# EAGLE design Flight control Prototipe (EAGLE 9.5.2)
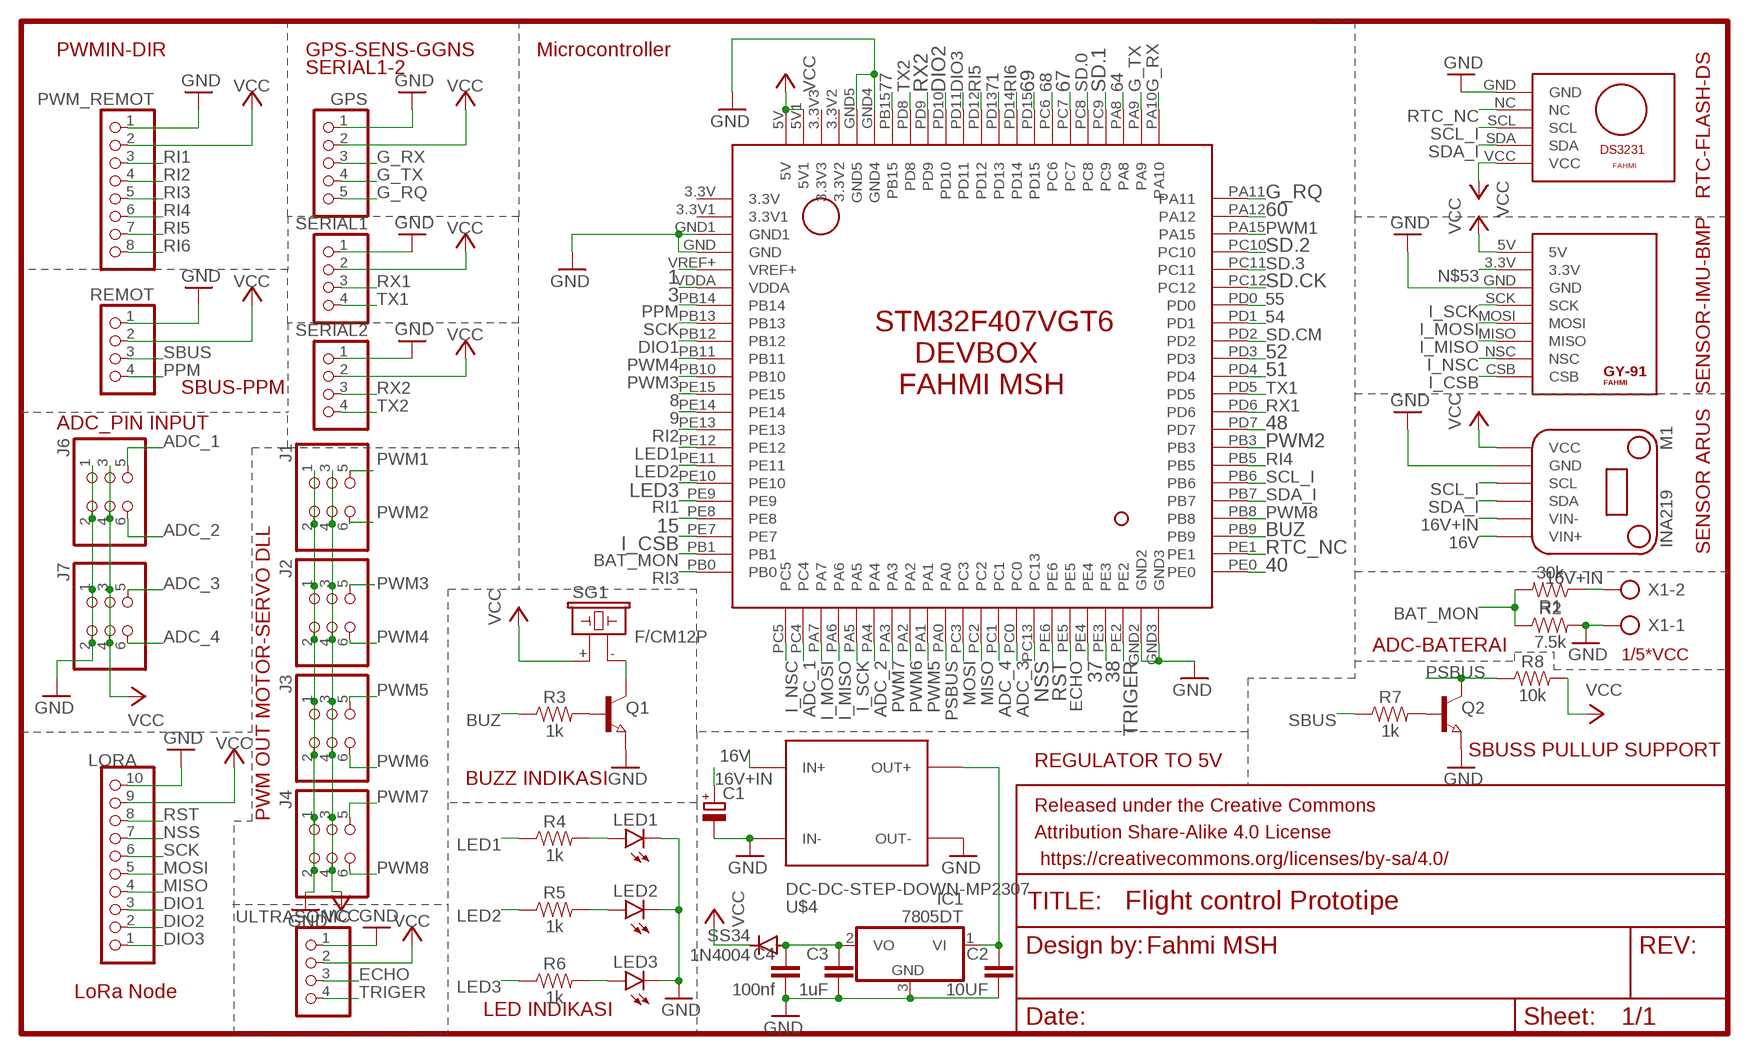
[diagram p0: schematic, sheet 1]

## Parts
C1  CPOL-EUE3.5-8  [E3,5-8]
C2  10UF  C-EUC0805K  [C0805K]
C3  1uF  C-EUC0805K  [C0805K]
C4  100nf  C-EUC0805K  [C0805K]
FRAME1  FRAME-LEDGER  [CREATIVE_COMMONS]
GPS  PINHD-1X5  [1X05]
IC1  7805DT  [TO252]
J1  PINHD-2X3  [2X03]
J2  PINHD-2X3  [2X03]
J3  PINHD-2X3  [2X03]
J4  PINHD-2X3  [2X03]
J6  PINHD-2X3  [2X03]
J7  PINHD-2X3  [2X03]
LED1  LED3MM  [LED3MM]
LED2  LED3MM  [LED3MM]
LED3  LED3MM  [LED3MM]
LORA  PINHD-1X10  [1X10]
M1  INA219  [INA219]
PWM_REMOT  PINHD-1X8  [1X08]
Q1  NPN-TRANSISTOR_SOT23  [SOT23]
Q2  NPN-TRANSISTOR_SOT23  [SOT23]
R1  30k  0.75OHM-0805-1/4W-1%  [0805]
R2  7.5k  0.75OHM-0805-1/4W-1%  [0805]
R3  1k  0.75OHM-0805-1/4W-1%  [0805]
R4  1k  0.75OHM-0805-1/4W-1%  [0805]
R5  1k  0.75OHM-0805-1/4W-1%  [0805]
R6  1k  0.75OHM-0805-1/4W-1%  [0805]
R7  1k  0.75OHM-0805-1/4W-1%  [0805]
R8  10k  0.75OHM-0805-1/4W-1%  [0805]
REMOT  PINHD-1X4  [1X04]
SERIAL1  PINHD-1X4  [1X04]
SERIAL2  PINHD-1X4  [1X04]
SG1  F/CM12P  [F/CM12P]
SS34  1N4004  [DO41-10]
U$1  STM32F4DEVBOX  [STM32F4DEVBOX]
U$2  GY-91  [GY-91]
U$3  DS3231MINI  [DS3231MINI]
U$4  DC-DC-STEP-DOWN-MP2307  [DC-DC-STEP-DOWN-MP2307]
ULTRASONIC  PINHD-1X4  [1X04]
X1  AK500/2  [AK500/2]

## Nets
1: U$1.VREF+
3: U$1.VDDA
8: U$1.PE15
9: U$1.PE14
15: U$1.PE8
16V: M1.VIN+ U$4.IN+
16V+IN: C1.+ M1.VIN- R1.1 X1.2
37: U$1.PE4
38: U$1.PE3
40: U$1.PE0
48: U$1.PD7
51: U$1.PD4
52: U$1.PD3
54: U$1.PD1
55: U$1.PD0
60: U$1.PA12
64: U$1.PA8
67: U$1.PC7
68: U$1.PC6
69: U$1.PD15
71: U$1.PD13
77: U$1.PB15
ADC_1: J6.5 U$1.PC4
ADC_2: J6.6 U$1.PA4
ADC_3: J7.5 U$1.PC0
ADC_4: J7.6 U$1.PC1
BAT_MON: R1.2 R2.1 U$1.PB1
BUZ: R3.1 U$1.PB9
DIO1: LORA.3 U$1.PB12
DIO2: LORA.2 U$1.PD10
DIO3: LORA.1 U$1.PD11
ECHO: U$1.PE5 ULTRASONIC.3
G_RQ: GPS.5 U$1.PA11
G_RX: GPS.3 U$1.PA10
G_TX: GPS.4 U$1.PA9
GND: C1.- C2.2 C3.2 C4.2 GPS.1 IC1.3(GND) J1.1 J1.2 J2.1 J2.2 J3.1 J3.2 J4.1 J4.2 J6.1 J6.2 J7.1 J7.2 LED1.K(C) LED2.K(C) LED3.K(C) LORA.10 M1.GND PWM_REMOT.1 Q1.2(E) Q2.2(E) R2.2 REMOT.1 SERIAL1.1 SERIAL2.1 U$1.GND U$1.GND1 U$1.GND2 U$1.GND3 U$1.GND4 U$1.GND5 U$2.GND U$3.GND U$4.IN- U$4.OUT- ULTRASONIC.1 X1.1
I_CSB: U$1.PE7 U$2.CSB
I_MISO: U$1.PA6 U$2.MISO
I_MOSI: U$1.PA7 U$2.MOSI
I_NSC: U$1.PC5 U$2.NSC
I_SCK: U$1.PA5 U$2.SCK
LED1: R4.1 U$1.PE12
LED2: R5.1 U$1.PE11
LED3: R6.1 U$1.PE10
MISO: LORA.4 U$1.PC2
MOSI: LORA.5 U$1.PC3
N$3: Q1.1(B) R3.2
N$4: Q1.3(C) SG1.-
N$6: LED1.A R4.2
N$7: LED2.A R5.2
N$8: LED3.A R6.2
N$9: C2.1 IC1.1(VI) U$4.OUT+
N$12: C3.1 C4.1 IC1.2(VO) SS34.A
N$21: Q2.1(B) R7.2
N$53: U$2.3.3V
NSS: LORA.7 U$1.PC13
PPM: REMOT.4 U$1.PB14
PSBUS: Q2.3(C) R8.1 U$1.PA0
PWM1: J1.5 U$1.PA15
PWM2: J1.6 U$1.PB3
PWM3: J2.5 U$1.PB10
PWM4: J2.6 U$1.PB11
PWM5: J3.5 U$1.PA1
PWM6: J3.6 U$1.PA2
PWM7: J4.5 U$1.PA3
PWM8: J4.6 U$1.PB8
RI1: PWM_REMOT.3 U$1.PE9
RI2: PWM_REMOT.4 U$1.PE13
RI3: PWM_REMOT.5 U$1.PB0
RI4: PWM_REMOT.6 U$1.PB5
RI5: PWM_REMOT.7 U$1.PD12
RI6: PWM_REMOT.8 U$1.PD14
RST: LORA.8 U$1.PE6
RTC_NC: U$1.PE1 U$3.NC
RX1: SERIAL1.3 U$1.PD6
RX2: SERIAL2.3 U$1.PD9
SBUS: R7.1 REMOT.3
SCK: LORA.6 U$1.PB13
SCL_I: M1.SCL U$1.PB6 U$3.SCL
SD.0: U$1.PC8
SD.1: U$1.PC9
SD.2: U$1.PC10
SD.3: U$1.PC11
SD.CK: U$1.PC12
SD.CM: U$1.PD2
SDA_I: M1.SDA U$1.PB7 U$3.SDA
TRIGER: U$1.PE2 ULTRASONIC.4
TX1: SERIAL1.4 U$1.PD5
TX2: SERIAL2.4 U$1.PD8
VCC: GPS.2 J1.3 J1.4 J2.3 J2.4 J3.3 J3.4 J4.3 J4.4 J6.3 J6.4 J7.3 J7.4 LORA.9 M1.VCC PWM_REMOT.2 R8.2 REMOT.2 SERIAL1.2 SERIAL2.2 SG1.+ SS34.C U$1.5V U$1.5V1 U$2.5V U$3.VCC ULTRASONIC.2
Unconnected: U$1.3.3V U$1.3.3V1 U$1.3.3V2 U$1.3.3V3

## Notes on the sheet
- PWMIN-DIR | GPS-SENS-GGNS | Microcontroller
- SERIAL1-2
- RTC-FLASH-DS
- SBUS-PPM | SENSOR-IMU-BMP
- ADC_PIN INPUT
- SENSOR ARUS
- ADC-BATERAI
- 1/5*VCC
- SBUSS PULLUP SUPPORT
- REGULATOR TO 5V
- BUZZ INDIKASI
- PWM OUT MOTOR-SERVO DLL
- Fahmi MSH
- LoRa Node
- LED INDIKASI

## Library data of the parts
C1 = rcl:CPOL-EU: POLARIZED CAPACITOR, European symbol; SPICEPREFIX: C
C2-C4 = rcl:C-EU: CAPACITOR, European symbol; SPICEPREFIX: C
FRAME1 = SparkFun-Aesthetics:FRAME-LEDGER: Schematic Frame - Ledger Standard 11x14 US Ledger frame
GPS = pinhead:PINHD-1X5: PIN HEADER
IC1 = linear:78*: Positive VOLTAGE REGULATOR Source: http://cache.national.com/ds/LM/LM78L05.pdf http://www.fairchildsemi.com/ds/LM/LM7805.pdf
J1-J4 J6 J7 = SparkFun-Retired:PINHD-2X3: PIN HEADER
LED1-LED3 = led:LED: LED OSRAM: - CHIPLED LG R971, LG N971, LY N971, LG Q971, LY Q971, LO R971, LY R971 LH N974, LH R974 LS Q976, LO Q976, LY Q976 LO Q996 - Hyper CHIPLED LW Q18S LB Q993, LB Q99A, LB R99A - SideLED LS A670, LO A670, LY A670, LG A670, LP A670 LB A673, LV A673, LT A673, LW A673 LH A674 LY A675 LS A676, LA A676, LO A676, LY A676, LW A676 LS A679, LY A679, LG A679 - Hyper Micro SIDELED® LS Y876, LA Y876, LO Y876, LY Y876 LT Y87S - SmartLED LW L88C, LW L88S LB L89C, LB L89S, LG L890 LS L89K, LO L89K, LY L89K LS L896, LA L896, LO L896, LY L896 - TOPLED LS T670, LO T670, LY T670, LG T670, LP T670 LSG T670, LSP T670, LSY T670, LOP T670, LYG T670 LG T671, LOG T671, LSG T671 LB T673, LV T673, LT T673, LW T673 LH T674 LS T676, LA T676, LO T676, LY T676, LB T676, LH T676, LSB T676, LW T676 LB T67C, LV T67C, LT T67C, LS T67K, LO T67K, LY T67K, LW E67C LS E67B, LA E67B, LO E67B, LY E67B, LB E67C, LV E67C, LT E67C LW T67C LS T679, LY T679, LG T679 LS T770, LO T770, LY T770, LG T770, LP T770 LB T773, LV T773, LT T773, LW T773 LH T774 LS E675, LA E675, LY E675, LS T675 LS T776, LA T776, LO T776, LY T776, LB T776 LHGB T686 LT T68C, LB T68C - Hyper Mini TOPLED® LB M676 - Mini TOPLED Santana® LG M470 LS M47K, LO M47K, LY M47K Source: http://www.osram.convergy.de LUXEON: - LUMILED® LXK2-PW12-R00, LXK2-PW12-S00, LXK2-PW14-U00, LXK2-PW14-V00 LXK2-PM12-R00, LXK2-PM12-S00, LXK2-PM14-U00 LXK2-PE12-Q00, LXK2-PE12-R00, LXK2-PE12-S00, LXK2-PE14-T00, LXK2-PE14-U00 LXK2-PB12-K00, LXK2-PB12-L00, LXK2-PB12-M00, LXK2-PB14-N00, LXK2-PB14-P00, LXK2-PB14-Q00 LXK2-PR12-L00, LXK2-PR12-M00, LXK2-PR14-Q00, LXK2-PR14-R00 LXK2-PD12-Q00, LXK2-PD12-R00, LXK2-PD12-S00 LXK2-PH12-R00, LXK2-PH12-S00 LXK2-PL12-P00, LXK2-PL12-Q00, LXK2-PL12-R00 Source: www.luxeon.com KINGBRIGHT: KA-3528ASYC Source: www.kingbright.com
LORA = pinhead:PINHD-1X10: PIN HEADER
M1 = INA219Module:INA219
PWM_REMOT = pinhead:PINHD-1X8: PIN HEADER
Q1 Q2 = semicon-smd-ipc:NPN-TRANSISTOR_: NPN TRANSISTOR
R1-R8 = SparkFun-Resistors:0.75OHM: 0.75Ω resistor A resistor is a passive two-terminal electrical component that implements electrical resistance as a circuit element. Resistors act to reduce current flow, and, at the same time, act to lower voltage levels within circuits. - Wikipedia; PROD_ID: RES-08474; VALUE: 0.75
REMOT SERIAL1 SERIAL2 ULTRASONIC = pinhead:PINHD-1X4: PIN HEADER
SG1 = buzzer:F/CM12P: BUZZER Source: Buerklin; OC_FARNELL: unknown; OC_NEWARK: unknown
SS34 = diode:1N4004: DIODE general purpose rectifier, 1 A
U$1 = STM32F4DEVBOX:STM32F4DEVBOX
U$2 = GY-91:GY-91
U$3 = DS3231MINI:DS3231MINI
U$4 = diy-modules:DC-DC-STEP-DOWN-MP2307: DC/DC Step-Down Regulator based on MP2307DN chip MP2307 datasheet available here: https://cdn-shop.adafruit.com/datasheets/MP2307_r1.9.pdf Click here to find device on ebay.com <http://www.ebay.com/sch/dc+dc+3a+mini+converter>
X1 = con-ptr500:AK500/2: CONNECTOR; OC_FARNELL: unknown; OC_NEWARK: unknown

## Board
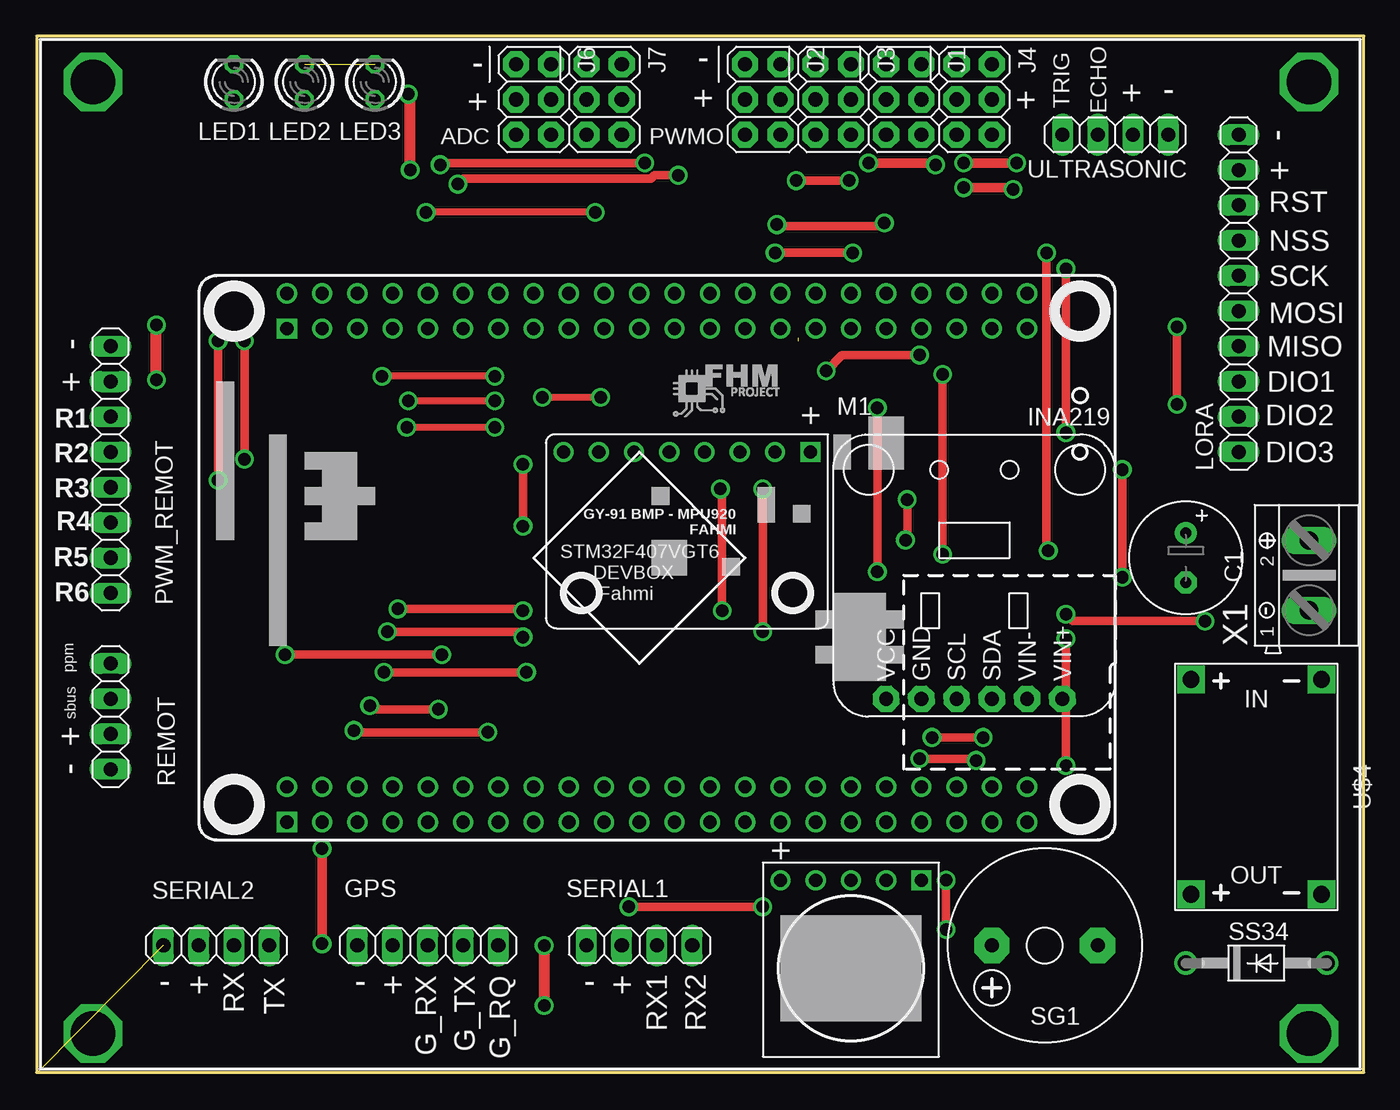
[diagram p1: board, top side]
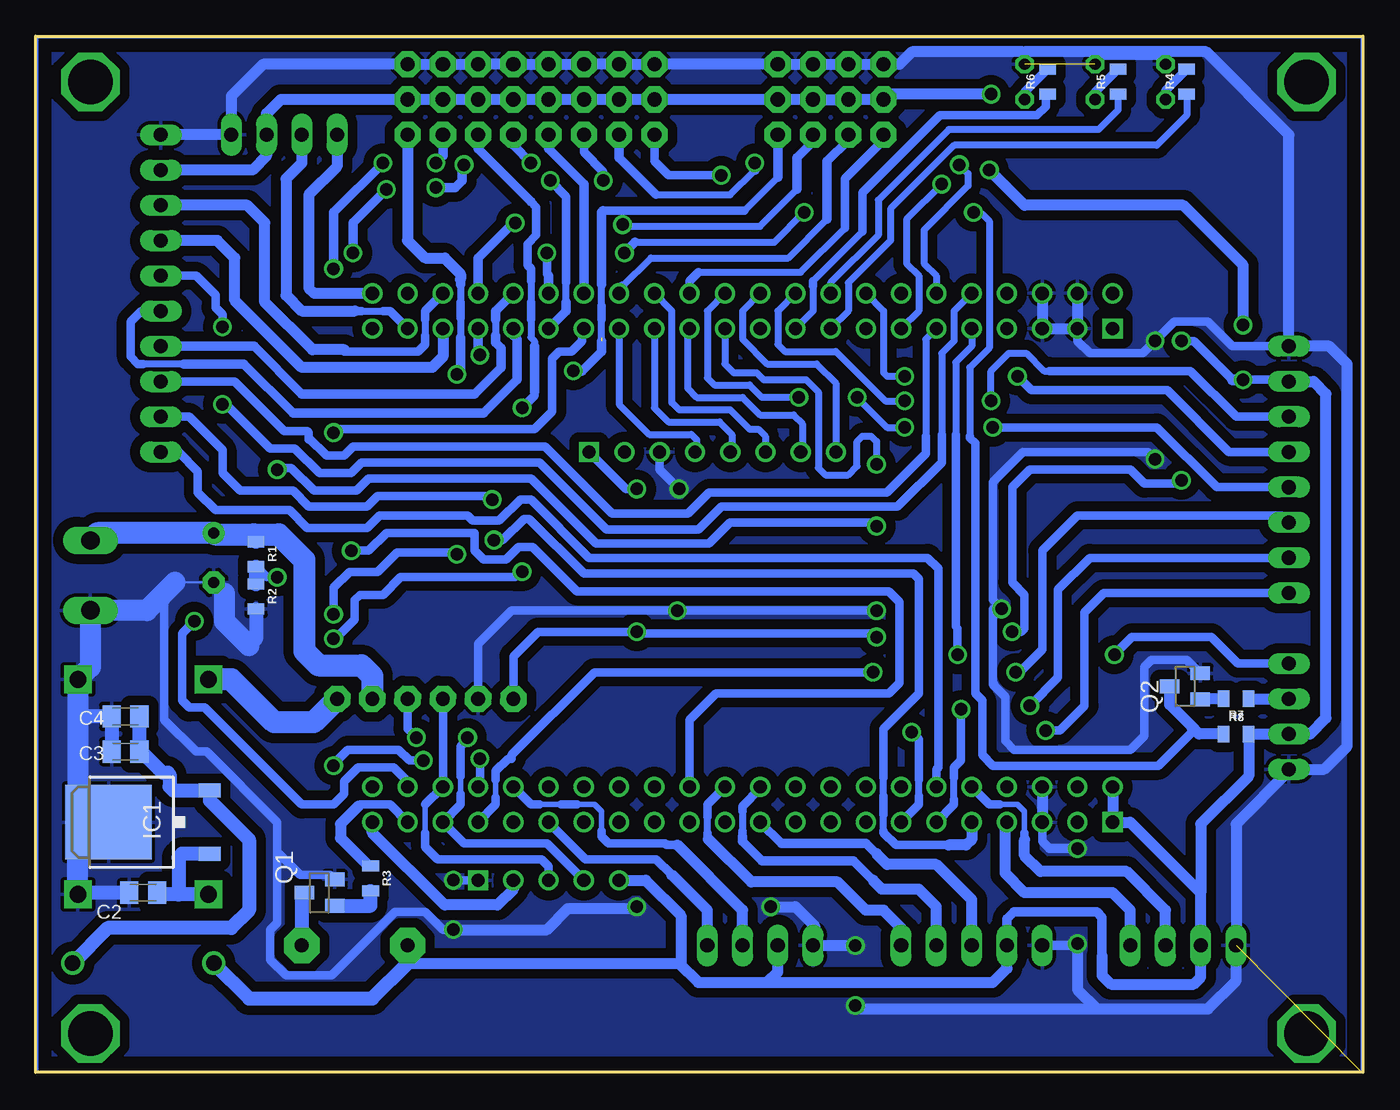
[diagram p2: board, bottom side, seen from below]

Size 95.63 x 74.68 mm. Coordinates in mm from the lower left corner, seen from the top.
Outline: 0,0 95.63,0 95.63,74.68 0,74.68 0,0
Copper layers (1*16): Top 0.035mm / dielectric 1.5mm / Bottom 0.035mm
Design rules "default": minimum track width 6mil, minimum drill 0.35mm, track to track 6mil, track to pad 6mil, pad to pad 6mil, via to via 6mil, smd to smd 6mil, copper to edge 40mil, drill to drill 6mil, minimum pad ring 10mil, minimum via ring 8mil, stop-mask expansion 4mil, vias tented up to drill 0mil, thermal gap 10mil

### Footprints (pad centres in the part's own frame; a part is rotated, then mirrored left to right if it is on the bottom)
E3,5-8 = drill 0.813 pad 1.6: + -1.778,0 | drill 0.813 pad 1.6 octagon: - 1.778,0
C0805K = smd 1.3 x 1.6: 1 -1,0; 2 1,0
1X05 = drill 1.016 long: 1 -5.08,0; 2 -2.54,0; 3 0,0; 4 2.54,0; 5 5.08,0
TO252 = smd 1 x 1.6: 1 -2.28,-4.8; 2 2.28,-4.8 | smd 5.4 x 6.2: 3 0,2.5
2X03 = drill 1.016 pad 1.88 octagon: 1 -2.54,-1.27; 2 -2.54,1.27; 3 0,-1.27; 4 0,1.27; 5 2.54,-1.27; 6 2.54,1.27
LED3MM = drill 0.813 octagon: A -1.27,0; K 1.27,0
1X10 = drill 1.016 long: 1 -11.43,0; 2 -8.89,0; 3 -6.35,0; 4 -3.81,0; 5 -1.27,0; 6 1.27,0; 7 3.81,0; 8 6.35,0; 9 8.89,0; 10 11.43,0
INA219 = drill 1 pad 1.9 octagon: GND 6.35,1.27; SCL 8.89,1.27; SDA 11.43,1.27; VCC 3.81,1.27; VIN+ 16.51,1.27; VIN- 13.97,1.27
1X08 = drill 1.016 long: 1 -8.89,0; 2 -6.35,0; 3 -3.81,0; 4 -1.27,0; 5 1.27,0; 6 3.81,0; 7 6.35,0; 8 8.89,0
SOT23 = smd 1 x 1.4: 1 -0.95,-1.1; 2 0.95,-1.1; 3 0,1.1
0805 = smd 0.8 x 1.2: 1 -0.9,0; 2 0.9,0
1X04 = drill 1.016 long: 1 -3.81,0; 2 -1.27,0; 3 1.27,0; 4 3.81,0
F/CM12P = drill 1.016 pad 2.54 octagon: + 3.81,0; - -3.81,0
DO41-10 = drill 1.118: A 5.08,0; C -5.08,0
STM32F4DEVBOX = drill 0.95 square: 3.3V 35.56,71.12; 5V1 0,71.12 | drill 0.95: 3.3V1 38.1,71.12; 3.3V2 2.54,68.58; 3.3V3 0,68.58; 5V 2.54,71.12; GND 35.56,68.58; GND1 38.1,68.58; GND2 35.56,66.04; GND3 38.1,66.04; GND4 2.54,66.04; GND5 0,66.04; PA0 38.1,30.48; PA1 35.56,30.48; PA2 38.1,33.02; PA3 35.56,33.02; PA4 38.1,35.56; PA5 35.56,35.56; PA6 38.1,38.1; PA7 35.56,38.1; PA8 0,48.26; PA9 2.54,45.72; PA10 0,45.72; PA11 2.54,43.18; PA12 0,43.18; PA15 2.54,40.64; PB0 38.1,43.18; PB1 35.56,43.18; PB3 2.54,25.4; PB5 0,25.4; PB6 2.54,22.86; PB7 0,22.86; PB8 2.54,20.32; PB9 0,20.32; PB10 35.56,55.88; PB11 38.1,58.42; PB12 35.56,58.42; PB13 38.1,60.96; PB14 35.56,60.96; PB15 2.54,63.5; PC0 38.1,25.4; PC1 35.56,25.4; PC2 38.1,27.94; PC3 35.56,27.94; PC4 38.1,40.64; PC5 35.56,40.64; PC6 0,53.34; PC7 2.54,50.8; PC8 0,50.8; PC9 2.54,48.26; PC10 0,40.64; PC11 2.54,38.1; PC12 0,38.1; PC13 35.56,22.86; PD0 2.54,35.56; PD1 0,35.56; PD2 2.54,33.02; PD3 0,33.02; PD4 2.54,30.48; PD5 0,30.48; PD6 2.54,27.94; PD7 0,27.94; PD8 0,63.5; PD9 2.54,60.96; PD10 0,60.96; PD11 2.54,58.42; PD12 0,58.42; PD13 2.54,55.88; PD14 0,55.88; PD15 2.54,53.34; PE0 2.54,17.78; PE1 0,17.78; PE2 38.1,17.78; PE3 35.56,17.78; PE4 38.1,20.32; PE5 35.56,20.32; PE6 38.1,22.86; PE7 38.1,45.72; PE8 35.56,45.72; PE9 38.1,48.26; PE10 35.56,48.26; PE11 38.1,50.8; PE12 35.56,50.8; PE13 38.1,53.34; PE14 35.56,53.34; PE15 38.1,55.88; VDDA 35.56,63.5; VREF+ 38.1,63.5
GY-91 = drill 0.95: 3.3V 3.81,1.27; CSB 19.05,1.27; GND 6.35,1.27; MISO 13.97,1.27; MOSI 11.43,1.27; NSC 16.51,1.27; SCK 8.89,1.27 | drill 0.95 square: 5V 1.27,1.27
DS3231MINI = drill 0.95 square: GND 1.27,1.27 | drill 0.95: NC 3.81,1.27; SCL 6.35,1.27; SDA 8.89,1.27; VCC 11.43,1.27
DC-DC-STEP-DOWN-MP2307 = drill 1.2 pad 2 square: IN+ -7.747,-4.699; IN- -7.747,4.699; OUT+ 7.747,-4.699; OUT- 7.747,4.699
AK500/2 = drill 1.321 long: 1 -2.515,0; 2 2.515,0

### Placement (x,y rotation side)
C1  82.8,37.08 270 top
C2  87.88,12.95 180 bottom
C3  89.15,23.11 180 bottom
C4  89.15,25.65 180 bottom
FRAME1  28.19,-8.64 0 top  (outside the outline)
GPS  28.19,9.14 0 top
IC1  87.88,18.03 90 bottom
J1  62.48,70.1 270 top
J2  52.32,70.1 270 top
J3  57.4,70.1 270 top
J4  67.56,70.1 270 top
J6  35.81,70.1 270 top
J7  40.89,70.1 270 top
LED1  14.22,71.37 90 top
LED2  19.3,71.37 90 top
LED3  24.38,71.37 90 top
LORA  86.61,56.13 90 top
M1  57.4,25.65 0 top
PWM_REMOT  5.33,43.43 270 top
Q1  75.18,12.95 90 bottom
Q2  12.83,27.81 90 bottom
R1  79.76,37.34 270 bottom
R2  79.76,34.29 270 bottom
R3  71.5,13.97 270 bottom
R4  12.7,71.37 90 bottom
R5  17.65,71.37 90 bottom
R6  22.73,71.37 90 bottom
R7  9.14,26.92 180 bottom
R8  9.14,24.38 0 bottom
REMOT  5.33,25.65 90 top
SERIAL1  43.43,9.14 0 top
SERIAL2  12.95,9.14 0 top
SG1  72.64,9.14 180 top
SS34  87.88,7.87 0 top
U$1  89.15,18.03 90 top
U$2  57.02,45.97 180 top
U$3  65.02,15.11 180 top
U$4  87.88,20.57 270 top
ULTRASONIC  77.72,67.56 180 top
X1  91.69,35.81 90 top

### Tracks (layer width: path | path; a pad name or v marks a point on that pad's centre or on a via)
16V
  Bottom 1.6: M1.VIN+ 75.62,25.22 78.43,25.22 81.53,28.32 U$4.IN+
16V+IN
  Bottom 1: R1.1 79.91,38.4 79.91,38.77
  Bottom 1.6: X1.2 91.16,38.86 C1.+ 82.71,38.77 79.91,38.77 78.12,38.77 76.29,36.94 76.29,30.36 75.26,29.33 72.15,29.33 71.37,28.56 M1.VIN-
ADC_1
  Bottom 0.5: 47.88,57.66 40.51,57.66 37.34,60.83
  Bottom 0.6: U$1.PC4 48.51,57.02 47.88,57.66 | J6.5 34.54,67.18 37.34,64.39 37.34,60.83
ADC_2
  Bottom 0.5: 53.34,56.64 51.31,58.67 41.4,58.67 38.61,61.47
  Bottom 0.7: U$1.PA4 53.34,56.39 53.34,56.64 | J6.6 37.08,67.18 38.61,65.66 38.61,61.47
ADC_3  (via drill 0.9)
  Top 0.6: v61.09,61.21 60.83,60.96 53.34,60.96 v53.34,61.09
  Bottom 0.5: v53.34,61.09 53.21,60.96 43.43,60.96 40.77,63.63
  Bottom 0.6: 63.75,58.67 61.15,61.28 v61.09,61.21
  Bottom 0.7: U$1.PC0 63.75,58.67 | J7.5 39.62,67.06 40.77,65.91 40.77,63.63
ADC_4  (via drill 0.9)  (1 unrouted)
  Top 0.6: v63.63,51.69 58.04,51.69 v56.9,50.55
  Bottom 0.5: 54.86,52.96 54.86,54.23 | 54.86,55.25 54.86,56.77 | 44.58,62.1 42.16,64.52
  Bottom 0.6: 54.86,54.23 54.86,55.25 | 54.74,62.1 44.58,62.1
  Bottom 0.7: U$1.PC1 63.75,51.82 v63.63,51.69 | v56.9,50.55 56.26,50.55 54.86,51.94 54.86,52.71 | 54.86,56.77 54.86,61.98 54.74,62.1 | 42.16,64.52 J7.6
BAT_MON  (via drill 0.9)
  Top 0.6: v35.05,43.82 v35.05,39.37 | v78.23,43.43 v78.23,35.69
  Bottom 0.5: U$1.PB1 45.97,51.05 45.34,50.42 43.69,50.42 43.18,49.91 40.13,49.91 39.24,49.02 39.24,43.56 38.74,43.05 37.08,43.05 36.45,43.69 36.45,45.47 36.07,45.85 35.43,45.85 35.05,45.47 v35.05,43.82
  Bottom 0.6: R1.2 79.01,35.69 v78.23,35.69 | v35.05,39.37 35.31,39.62 45.59,39.62 47.12,38.1 55.25,38.1 59.94,42.8 71.63,42.8 72.52,41.91 75.57,41.91 77.22,43.56 78.11,43.56 v78.23,43.43
  Bottom 1: R2.1 R1.2
BUZ
  Bottom 0.6: U$1.PB9 70.1,19.3 72.26,19.3 72.39,19.18
  Bottom 0.8: 72.39,19.18 73.66,17.91 73.66,16.89 71.64,14.87 R3.1
DIO1
  Bottom 0.5: U$1.PB12 31.5,52.83 31.5,45.85
  Bottom 0.6: 85.09,49.78 LORA.3 81.28,49.78 77.72,46.23 76.07,46.23 75.95,46.1 75.95,45.72 | 75.95,45.72 75.95,45.59 | 31.5,45.85 31.5,44.58 34.29,41.78 47.12,41.78 48.64,40.26 54.1,40.26 58.93,45.09 72.77,45.09 73.41,44.45 74.68,44.45 75.95,45.72
DIO2  (via drill 0.9)
  Top 0.6: v62.74,41.28 62.74,38.48 v62.61,38.35
  Bottom 0.5: 34.54,17.27 34.54,18.54 | 34.54,19.94 34.54,21.21
  Bottom 0.6: 29.85,16.38 33.66,16.38 34.54,17.27 34.54,17.4 | 34.54,18.54 34.54,19.94 | LORA.2 84.58,47.24 82.17,44.83 82.17,43.18 80.9,41.91 77.09,41.91 75.95,40.77 71.76,40.77 70.99,41.53 62.74,41.53 v62.74,41.28 | v62.61,38.35 61.98,38.35 60.45,39.88 60.07,39.88 56.13,35.94 32.39,35.94 32,35.56 32,27.31 34.54,24.77 34.54,21.21
  Bottom 0.8: U$1.PD10 28.19,16.76 28.58,16.38 29.85,16.38
DIO3
  Bottom 0.6: U$1.PD11 30.73,21.84 30.61,21.97 30.61,36.32 31.37,37.08 55.75,37.08 59.94,41.28 60.71,41.28 62.23,39.75 64.14,39.75 64.52,40.13 70.87,40.13 71.76,39.24 76.07,39.24 77.34,40.51 82.68,40.51 83.95,41.78 83.95,43.31 85.34,44.7 LORA.1
ECHO
  Bottom 0.5: 72.14,54.86 70.61,54.86
  Bottom 0.6: 72.64,54.86 72.14,54.86 | 70.61,54.86 70.1,54.86 U$1.PE5
  Bottom 0.8: 72.64,54.86 76.45,54.86 77.6,56.01 77.6,64.39 76.45,65.53 ULTRASONIC.3
G_RQ
  Bottom 0.5: 47.24,16.89 47.24,18.42
  Bottom 0.6: 47.16,16.81 47.24,16.89 47.24,17.27 | 47.24,18.42 47.24,19.3 U$1.PA11
  Bottom 0.8: GPS.5 33.27,10.41 34.54,11.68 35.81,11.68 37.85,13.72 44.07,13.72 47.16,16.81
G_RX
  Bottom 0.7: 35.05,15.75 35.81,16.51 41.91,16.51 U$1.PA10
  Bottom 0.8: GPS.3 28.19,12.45 30.73,14.99 34.29,14.99 35.05,15.75
G_TX
  Bottom 0.5: 44.7,18.8 44.7,17.4
  Bottom 0.6: 44.7,17.4 44.7,17.02 | U$1.PA9 43.43,20.45 44.7,19.18 44.7,18.8
  Bottom 0.7: 35.31,13.84 36.7,15.24 43.31,15.24 44.7,16.64 44.7,17.02
  Bottom 0.8: GPS.4 30.73,11.94 32,13.21 34.67,13.21 35.31,13.84
GND  (via drill 0.9)  (2 unrouted)
  Top 0.6: v65.53,13.84 v65.53,10.29 | v52.32,11.94 v42.67,11.94 | v49.28,42.04 49.4,41.91 v49.4,33.27 | v14.99,52.71 v14.99,44.2 | v26.04,33.4 34.93,33.4 v35.05,33.27
  Top 0.7: v20.57,16.13 v20.57,9.27
  Top 0.8: v36.58,9.14 v36.58,4.83
  Bottom 0.152: 85.6,35.31 C1.- 82.04,34.54
  Bottom 0.19: 0.06,0.03 95.49,0.03 95.5,0.02 95.5,74.57 95.51,74.58 0.1,74.58 0.1,0.03 0.09,0.03
  Bottom 0.6: Q1.2 74.4,14.22 76.58,14.22 78.23,15.88 | 78.23,15.88 78.23,18.03 83.31,23.11 84.07,23.11 86.36,25.4 86.36,34.04 86.61,34.29 | 78.23,15.88 78.23,10.8 78.74,10.29 78.74,8.13 77.6,6.99 74.3,6.99 69.72,11.56 67.56,11.56 66.29,10.29 v65.53,10.29 | U$3.GND v65.53,13.84 | U$1.GND5 23.11,16.64 22.61,16.13 | U$2.GND 50.67,43.43 v49.28,42.04 | M1.GND 63.75,30.86 61.34,33.27 v49.4,33.27 v35.05,33.27 | U$1.GND 20.57,52.71 19.69,51.82 15.88,51.82 v14.99,52.71 13.59,54.1 11.18,54.1 9.4,52.32 PWM_REMOT.1 | v14.99,44.2 15.49,44.7 24.51,44.7 26.67,42.55 26.67,34.04 v26.04,33.4 26.67,33.4 26.67,28.07 | 26.67,28.07 26.54,27.94 | 26.67,28.07 26.67,27.94 25.78,27.05 25.78,23.88 25.15,23.24 16.76,23.24 15.75,24.26 15.75,29.21 15.24,29.72 12.68,29.72 Q2.2
  Bottom 0.61: LED1.K 14.22,73.24 14.48,73.24 14.6,73.24 19.3,73.24 LED2.K
  Bottom 0.7: 22.61,16.13 v20.57,16.13 | v20.57,9.27 20.7,9.14 GPS.1
  Bottom 0.8: v65.53,10.29 58.8,10.29 57.28,11.81 52.45,11.81 v52.32,11.94 | v42.67,11.94 40.89,11.94 39.5,10.54 39.5,9.27 SERIAL1.1 v36.58,9.14 | U$1.GND4 U$1.GND5 | v20.57,9.27 20.57,5.97 19.18,4.57 | 19.18,4.57 11.18,4.57 9.14,6.6 SERIAL2.1 9.14,17.91 5.33,21.72 REMOT.1 2.79,21.84 1.14,23.5 1.14,51.05 2.41,52.32 PWM_REMOT.1 5.33,67.56 11.3,73.53 19.3,73.53 19.43,73.53 24.38,73.53 LED3.K | v36.58,4.83 36.32,4.57 19.18,4.57 | LORA.10 ULTRASONIC.1 81.53,70.36 79.25,72.64 J4.2 J4.1 J1.2 J1.1 J3.2 J3.1 J2.2 J2.1 J7.2 J7.1 J6.2 J6.1 33.4,72.64 32.51,73.53 24.51,73.53 | U$1.GND1 U$1.GND U$1.GND2 U$1.GND3
  Bottom 1: 92.58,25.65 C4.2 C3.2 | C2.2 92.46,12.95 U$4.OUT- | R2.2 79.76,31.24 80.26,30.73
  Bottom 1.5: 85.6,35.31 86.61,34.29 87.63,33.27 91.69,33.27 | X1.1 91.69,29.21 U$4.IN- 92.58,25.65 92.58,20.19 90.42,18.03 IC1.3 | 82.04,34.54 82.04,32.51 80.26,30.73 | 89.15,18.03 IC1.3 | U$4.OUT- 92.58,17.15 91.69,18.03 IC1.3
  pour Bottom (isolate 0.7): 0.25,0.25 95.25,0.25 95.38,0.13 95.38,74.42 0.25,74.42
I_CSB
  Bottom 0.5: U$1.PE7 44.7,54.86 44.7,52.83 42.93,51.05 39.37,51.05 37.97,49.66 U$2.CSB
I_MISO
  Bottom 0.5: U$1.PA6 49.78,54.86 49.78,48.26 49.28,47.75 45.59,47.75 44.2,46.36 43.56,46.36 43.05,45.85 U$2.MISO
I_MOSI
  Bottom 0.5: U$1.PA7 51.05,47.88 50.04,46.86 46.36,46.86 45.47,45.97 45.47,44.83 U$2.MOSI
I_NSC
  Bottom 0.5: U$1.PC5 48.64,53.47 48.64,49.28 48.01,48.64 44.7,48.64 43.43,47.37 41.02,47.37 40.39,46.74 40.39,44.83 U$2.NSC
I_SCK
  Bottom 0.5: U$1.PA5 53.59,48.13 51.44,45.97 48.39,45.97 48.01,45.59 48.01,44.83 U$2.SCK
LED1
  Bottom 0.5: R4.1 12.7,68.96 14.86,66.8 29.46,66.8 34.04,62.23 34.04,59.94 37.08,56.9 37.08,54.86 U$1.PE12
LED2
  Bottom 0.5: R5.1 17.65,69.34 19.05,67.95 29.85,67.95 34.93,62.87 34.93,60.33 38.35,56.9 U$1.PE11
LED3
  Bottom 0.5: U$1.PE10 39.62,54.86 39.62,56.64 | 36.07,60.58 39.62,57.02
  Bottom 0.6: R6.1 22.86,70.35 22.86,69.6 23.5,68.96 30.48,68.96 36.07,63.37 36.07,60.58 | 39.62,57.02 39.62,56.64
MISO
  Bottom 0.5: 62.48,54.23 62.48,53.09
  Bottom 0.7: U$1.PC2 62.48,54.86 62.48,54.23 | 62.48,53.09 62.48,52.58 62.1,52.2 62.1,50.8 64.01,48.9 76.45,48.9 79.88,52.32 LORA.4
MOSI
  Bottom 0.5: 84.96,51.05 87.88,51.05
  Bottom 0.6: 87.88,51.05 88.27,51.05 88.77,51.56 88.77,54.1 88.01,54.86 LORA.5
  Bottom 0.7: U$1.PC3 61.21,53.09 60.96,52.83 60.96,49.91 63.37,47.5 77.09,47.5 80.65,51.05 84.96,51.05
N$1  (via drill 3.2)
  other vias: 91.69,71.37
N$2  (via drill 3.2)
  other vias: 91.69,2.79
N$3
  Bottom 1: Q1.1 71.5,12 R3.2
N$4
  Bottom 1: Q1.3 76.45,12.95 SG1.-
N$5  (via drill 3.2)
  other vias: 4.06,2.79
N$6
  Bottom 0.6: R4.2 14.22,70.75 LED1.A
N$7
  Bottom 0.6: R5.2 19.3,70.62 LED2.A
N$8
  Bottom 0.6: R6.2 24.38,70.62 LED3.A
N$9
  Bottom 1: U$4.OUT+ 85.34,12.83 | 85.34,12.83 86.76,12.83 C2.1 | IC1.1 85.08,15.75 85.34,15.49 85.34,12.83
N$10  (via drill 3.2)
  other vias: 4.06,71.37
N$12
  Bottom 1: C4.1 C3.1 88.01,23.11 86.49,21.59 86.11,21.59 85.98,21.46 85.98,20.57 85.72,20.31 IC1.2 83.08,19.58 80.26,16.76 80.26,11.68 81.53,10.41 90.42,10.41 SS34.A
N$21
  Bottom 0.8: R7.2 11.67,26.92 Q2.1
NSS
  Bottom 0.8: U$1.PC13 66.29,51.56 67.06,50.8 76.45,50.8 81.28,55.63 81.28,58.67 82.55,59.94 LORA.7
PPM  (via drill 0.9)
  Top 0.6: v29.21,30.1 v17.91,30.1
  Bottom 0.5: U$1.PB14 28.19,52.32 29.34,51.18 29.34,45.97 29.34,45.72
  Bottom 0.6: 29.34,45.97 29.34,32.13 29.21,32 v29.21,30.1 | v17.91,30.1 16.64,31.37 10.92,31.37 9.02,29.46 REMOT.4
PSBUS  (via drill 0.9)
  Top 0.5: v40.26,61.98 v28.07,61.98
  Top 0.6: v58.8,59.06 v53.21,59.06
  Bottom 0.5: v40.26,61.98 42.42,59.82 52.45,59.82 | v28.07,61.98 27.94,61.85 27.43,61.85 26.92,61.34 26.92,52.2 28.32,50.8 28.32,45.85
  Bottom 0.6: 58.67,57.4 58.8,57.53 v58.8,59.06 | 28.32,45.85 28.32,45.72 27.94,45.34 27.94,27.31 27.43,26.8 27.43,22.86 26.67,22.1 14.73,22.1 12.38,24.45 12.38,24.96
  Bottom 0.7: U$1.PA0 58.67,57.4 | v53.21,59.06 52.45,59.82
  Bottom 0.8: Q2.3 13.93,26.5 12.38,24.96 11.81,24.38 R8.1
PWM1  (via drill 0.9)
  Top 0.6: v72.77,59.06 72.77,37.72 v72.9,37.59
  Top 0.7: v59.94,65.53 64.64,65.53 v64.77,65.41 | v66.8,63.75 70.23,63.75 v70.36,63.63
  Bottom 0.6: v72.9,37.59 71.63,37.59 70.36,38.86 64.01,38.86 64.01,37.59 63.37,36.96 61.72,36.96 60.83,37.85 59.82,37.85 56.64,34.67 34.16,34.67 33.4,33.91 33.4,28.07 34.16,27.31 46.61,27.31 48.51,25.4 U$1.PA15
  Bottom 0.7: J1.5 61.21,66.8 v59.94,65.53 | v64.77,65.41 64.9,65.28 64.9,64.26 65.41,63.75 v66.8,63.75 | v70.36,63.63 72.77,61.21 v72.77,59.06
PWM2  (via drill 0.9)
  Top 0.6: v63.63,22.61 67.56,22.61 v67.69,22.48 | v74.17,31.24 v74.17,22.1 | v60.58,47.88 v60.58,36.07
  Bottom 0.5: 59.94,57.02 59.94,55.5 | 59.69,52.2 59.69,52.32 59.69,52.71 59.94,52.96 59.94,54.23
  Bottom 0.6: U$1.PB3 63.63,20.7 v63.63,22.61 | v67.69,22.48 68.71,22.48 69.47,23.24 73.15,23.24 74.17,22.23 v74.17,22.1 | 59.94,55.5 59.94,54.23 | 59.94,62.74 59.56,62.36 59.56,60.33 60.2,59.69 60.2,58.17 59.94,57.91 59.94,57.02 | 59.69,49.02 59.69,48.77 v60.58,47.88 | v60.58,36.07 60.71,36.07 61.09,35.69 69.34,35.69 70.61,34.42 72.26,34.42 72.64,34.04 72.64,32.64 74.04,31.24 v74.17,31.24
  Bottom 0.7: J1.6 63.75,66.55 59.94,62.74 | 59.69,52.32 59.69,49.02
PWM3  (via drill 0.9)
  Top 0.6: v46.23,64.64 44.52,64.64 44.28,64.4 30.75,64.4 v30.35,64.01
  Bottom 0.5: v30.35,64.01 32.89,61.47 32.89,58.29 32,57.4 32,54.86 U$1.PB10
  Bottom 0.6: J2.5 51.05,65.66 50.04,64.64 v46.23,64.64
PWM4  (via drill 0.9)
  Top 0.6: v43.82,65.53 29.21,65.53 v29.08,65.41
  Bottom 0.5: 50.93,63.25 45.59,63.25 43.82,65.02 | v29.08,65.41 28.45,64.77 28.45,63.88 31.62,60.71 31.62,58.29 30.73,57.4 U$1.PB11
  Bottom 0.6: 53.59,65.91 50.93,63.25
  Bottom 0.7: J2.6 53.59,65.91 | 43.82,65.02 v43.82,65.53
PWM5  (via drill 0.9)
  Top 0.6: v58.55,64.26 v54.74,64.26
  Bottom 0.5: 57.4,55.5 57.4,56.9
  Bottom 0.6: 57.4,56.9 57.4,63.12 v58.55,64.26 | v54.74,64.26 54.74,64.9 56.13,66.29 J3.5
  Bottom 0.7: U$1.PA1 57.4,54.86 57.4,55.5
PWM6
  Bottom 0.7: J3.6 58.67,66.55 56.13,64.01 U$1.PA2
PWM7  (via drill 0.9)
  Top 0.6: v74.17,57.91 v74.17,46.1
  Top 0.7: v66.8,65.53 v70.61,65.53
  Bottom 0.6: U$1.PA3 56.26,53.47 56.26,52.71 57.02,51.94 57.91,51.94 58.42,51.44 58.42,47.63 59.69,46.36 73.91,46.36 v74.17,46.1
  Bottom 0.7: J4.5 66.29,66.04 v66.8,65.53 | v70.61,65.53 74.17,61.98 v74.17,57.91
PWM8  (via drill 0.9)
  Top 0.6: v84.2,32.51 74.68,32.51 v74.17,33.02 | v65.28,50.29 v65.28,37.34
  Bottom 0.5: 65.02,56.77 65.02,55.5 | 65.02,54.36 65.02,52.96
  Bottom 0.6: U$1.PB8 68.83,20.96 69.85,21.97 72.39,21.97 73.41,20.96 73.41,20.07 74.17,19.3 76.45,19.3 83.44,26.29 84.58,26.29 85.09,26.8 85.09,31.62 v84.2,32.51 | 65.02,55.5 65.02,54.36 | v74.17,33.02 74.17,34.93 73.03,36.07 70.99,36.07 69.6,37.47 65.41,37.47 v65.28,37.34
  Bottom 0.7: 65.02,57.15 65.02,56.77 | v65.28,50.29 65.28,50.42 65.02,50.67 65.02,52.96
  Bottom 0.8: 65.02,57.15 65.02,57.53 66.17,58.67 67.56,58.67 68.83,59.94 J4.6
RI1  (via drill 0.9)
  Top 0.5: v33.02,48.39 v26.8,48.39
  Bottom 0.5: U$1.PE9 42.16,54.86 42.16,52.45 41.66,51.94 37.97,51.94 34.42,48.39 v33.02,48.39 | 22.61,50.55 22.99,50.55 24.26,51.82 25.53,51.82 26.8,50.55 v26.8,48.39
  Bottom 0.6: 22.61,50.55 12.45,50.55 9.14,47.24 PWM_REMOT.3
RI2  (via drill 0.9)
  Top 0.5: v33.02,50.17 v24.89,50.17
  Bottom 0.5: U$1.PE13 34.54,54.86 34.54,50.42 34.29,50.17 v33.02,50.17
  Bottom 0.6: v24.89,50.17 23.88,49.15 14.1,49.15 9.65,44.7 PWM_REMOT.4
RI3  (via drill 0.9)
  Top 0.5: v40.64,48.64 v36.45,48.64 | v33.02,46.48 v26.67,46.48
  Bottom 0.5: U$1.PB0 47.24,54.86 47.24,50.04 46.74,49.53 44.2,49.53 43.31,48.64 v40.64,48.64 | v36.45,48.64 34.29,46.48 v33.02,46.48
  Bottom 0.6: v26.67,46.48 14.86,46.48 10.54,42.16 PWM_REMOT.5
RI4  (via drill 0.9)
  Top 0.6: v25.02,28.83 v35.31,28.83
  Bottom 0.4: 62.48,19.81 62.48,21.08
  Bottom 0.6: U$1.PB5 62.48,19.3 62.48,19.81 | 62.48,21.08 62.48,21.72 61.6,22.61 61.34,22.61 61.34,22.86 55.37,28.83 v35.31,28.83 | PWM_REMOT.6 5.84,40.13 20.57,40.13 23.11,37.59 23.11,30.48 24.77,28.83 v25.02,28.83
RI5  (via drill 0.9)
  Top 0.6: v28.96,26.16 24.26,26.16 v24,26.42
  Bottom 0.5: 29.46,19.69 29.46,21.21
  Bottom 0.6: U$1.PD12 29.46,19.3 29.46,19.69 | v28.96,26.16 28.96,22.48 29.46,21.97 29.46,21.21 | v24,26.42 21.97,28.45 21.97,34.8 19.69,37.08 PWM_REMOT.7
RI6  (via drill 0.9)
  Top 0.6: v32.51,24.51 22.99,24.51 v22.86,24.64
  Bottom 0.5: 32,19.94 32,21.08
  Bottom 0.6: U$1.PD14 32,19.3 32,19.94 | v32.51,24.51 32,24 32,21.08 | v22.86,24.64 21.84,24.64 20.07,26.42 20.07,33.15 18.67,34.54 PWM_REMOT.8
RST
  Bottom 0.5: 67.56,54.23 67.56,53.09
  Bottom 0.6: U$1.PE6 67.56,54.86 67.56,54.23 | 67.56,53.09 67.56,52.45 68.07,51.94 73.41,51.94 73.41,52.07
  Bottom 0.8: 73.41,52.07 75.69,52.07 79.12,55.5 79.12,61.21 80.39,62.48 LORA.8
RTC_NC
  Bottom 0.8: U$3.NC 61.21,13.21 62.36,12.07 66.17,12.07 71.37,17.27 U$1.PE1
RX1
  Bottom 0.4: 54.86,17.4 54.86,18.8 55.37,19.3 56.64,19.3 | 57.79,19.3 59.31,19.3
  Bottom 0.6: 49.4,16.38 50.17,16.38 50.29,16.51 54.36,16.51 54.86,17.02 54.86,17.4 | 56.64,19.3 57.79,19.3 | 59.31,19.3 59.94,19.3 U$1.PD6
  Bottom 0.8: SERIAL1.3 44.7,11.68 49.4,16.38
RX2
  Bottom 0.4: 24.38,17.27 24.38,18.8 24.89,19.3 26.16,19.3
  Bottom 0.6: 24.38,16.76 24.38,17.27 | 26.16,19.3 26.92,19.3 U$1.PD9
  Bottom 0.8: SERIAL2.3 14.22,11.68 17.02,14.48 23.24,14.48 24.38,15.62 24.38,16.76
SBUS
  Bottom 0.8: R7.1 REMOT.3
SCK  (via drill 0.9)
  Top 0.6: v82.17,48.13 v82.17,53.72
  Bottom 0.5: U$1.PB13 29.46,54.86 29.46,52.71 30.35,51.82 30.35,45.97 30.35,45.72
  Bottom 0.6: LORA.6 84.07,57.4 82.68,56.01 82.68,55.12 82.17,54.61 v82.17,53.72 | 30.35,45.97 30.35,43.94 33.53,40.77 46.23,40.77 47.88,39.12 54.48,39.12 59.31,43.94 72.14,43.94 72.9,43.18 75.18,43.18 76.96,44.96 78.74,44.96 81.92,48.13 v82.17,48.13
SCL_I
  Bottom 0.4: 67.56,17.27 67.56,19.3
  Bottom 0.6: U$3.SCL 58.67,14.86 59.18,15.37 66.68,15.37 67.56,16.26 67.56,17.27 | 67.56,19.3 U$1.PB6 M1.SCL
SDA_I  (via drill 0.9)
  Top 0.6: v68.2,24.13 v64.52,24.13
  Bottom 0.4: 65.02,21.34 65.02,20.07
  Bottom 0.6: U$3.SDA 58.8,16.51 64.77,16.51 U$1.PB7 65.02,19.3 65.02,20.07 | v68.2,24.13 68.83,24.77 M1.SDA | v64.52,24.13 64.52,24 65.02,23.5 65.02,21.34
TRIGER
  Bottom 0.8: U$1.PE2 75.57,56.13 75.95,56.52 75.95,63.25 73.91,65.28 ULTRASONIC.4
TX1
  Bottom 0.6: 49.78,14.22 50.93,15.37 56.01,15.37 U$1.PD5
  Bottom 0.8: SERIAL1.4 47.24,11.68 49.78,14.22
TX2
  Bottom 0.8: SERIAL2.4 16.76,11.68 18.03,12.95 24.38,12.95 25.78,14.35 25.78,17.91 U$1.PD8
VCC  (via drill 0.9)
  Top 0.6: v52.32,42.04 v52.32,31.75 | v13.08,52.71 v13.08,42.67 | v25.27,31.75 34.67,31.75 v35.05,31.37
  Top 0.8: v8.64,49.91 v8.64,53.85 | v26.92,65.02 26.92,70.36 v26.8,70.49
  Bottom 0.6: U$2.5V 53.09,42.04 v52.32,42.04 | M1.VCC 61.21,29.97 59.44,31.75 v52.32,31.75 52.2,31.62 35.31,31.62 v35.05,31.37 | v8.64,49.91 5.46,49.91 PWM_REMOT.2 | v13.08,52.71 12.19,52.71 9.4,49.91 | v13.08,42.67 13.34,42.42 15.75,42.42 16.76,43.43 24,43.43 25.27,42.16 25.27,35.31 24.38,34.42 24.38,32 24.64,31.75 v25.27,31.75
  Bottom 0.7: 18.8,8.38 18.8,11.18 19.18,11.56 25.15,11.56 25.65,11.05 GPS.2
  Bottom 0.8: 49.15,7.87 49.15,11.3 51.69,13.84 U$3.VCC | 49.15,7.87 49.15,7.75 | 68.83,7.87 49.28,7.87 | 49.28,7.87 49.15,7.87 | 42.93,6.48 42.16,7.24 SERIAL1.2 | 49.28,7.87 47.88,6.48 42.93,6.48 | 42.93,6.48 26.67,6.48 25.65,7.49 GPS.2 | U$1.5V U$1.5V1 16.76,18.03 11.68,12.95 | 18.8,8.38 18.8,6.99 18.16,6.35 12.19,6.35 11.68,6.86 SERIAL2.2 11.68,12.95 | 11.68,12.95 11.68,17.91 8.24,21.35 R8.2 REMOT.2 3.81,24.38 2.67,25.53 2.67,48.9 3.56,49.78 PWM_REMOT.2 | LORA.9 80.01,65.02 78.99,66.04 ULTRASONIC.2 78.99,69.09 77.98,70.1 J4.4 J4.3 J1.4 J1.3 J3.4 J3.3 J2.4 J2.3 J7.4 J7.3 J6.4 J6.3 34.16,70.49 v26.8,70.49 | 9.4,49.91 v8.64,49.91 | v8.64,53.85 8.64,58.17 12.95,62.48 24.38,62.48 v26.92,65.02
  Bottom 1: SS34.C 80.26,5.33 71.37,5.33 68.83,7.87 SG1.+

### Text on the board
tPlace: - | - | + | + | + | TRIG | ECHO | + | - | ADC | PWMO | - | + | RST | NSS | SCK | MOSI | - | MISO | + | DIO1 | C:/Users/NUHKA ART/Pictures/Fahmi Project logo.bmp' | R1 | R1 | + | DIO2 | R2 | DIO3 | R3 | R4 | + | R5 | R6 | - | ppm | sbus | + | - | + | - | RX | - | - | RX1 | RX2 | TX | G_RX | G_TX | G_RQ | + | + | + | Fahmi MSH